# Altium schematic sheet MPU-6050_SCHEMATIC.SchDoc
size A4; SheetNumber: 1; SheetTotal: 1
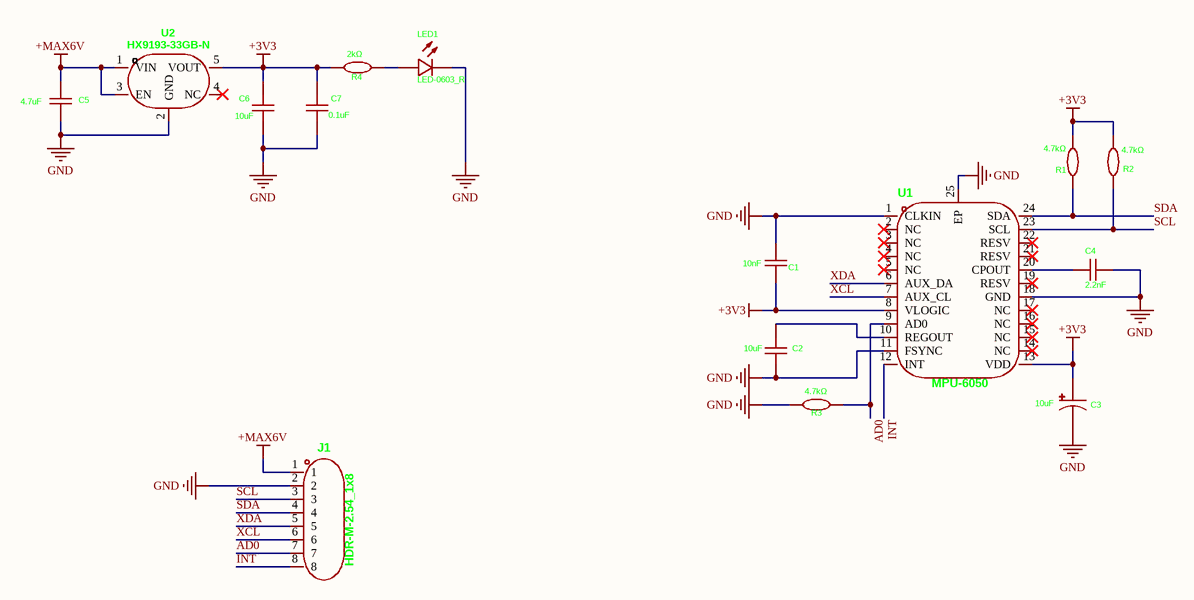
[diagram p0: MPU-6050_SCHEMATIC.SchDoc]

## Parts
C1  10nF  [C0402-10N F]
C2  10uF  [C0402-10u F]
C3  10uF  [CAP-SMD_L3.2-W1.6-10u F]
C4  2.2nF  [C0402-2.2n F]
C5  4.7uF  [C0402-4.7U F]
C6  10uF  [C0402-10u F]
C7  0.1uF  [C0402-0.1u f]
J1  HDR-M-2.54_1x8  [HDR-TH_8P-P2.54-V-M]
LED1  LED-0603_R  [LED0603-RD]
R1  4.7kΩ  [R0402-4.7K ohm]
R2  4.7kΩ  [R0402-4.7K ohm]
R3  4.7kΩ  [R0402-4.7K ohm]
R4  2kΩ  [R0402-2.2K OHM]
U1  MPU-6050  [QFN-24_L4.0-W4.0-P0.50-BL-EP2.7]
U2  HX9193-33GB-N  [SOT-23-5_L2.9-W1.6-P0.95-LS2.8-BL]

## Nets
+3V3: C1.1 C3.1 C6.2 C7.2 R1.2 R2.2 R4.1 U1.8(VLOGIC) U1.13(VDD) U2.5(VOUT)
+MAX6V: C5.2 J1.1 U2.1(VIN) U2.3(EN)
GND: C1.2 C2.1 C3.2 C4.1 C5.1 C6.1 C7.1 J1.2 LED1.1(C) R3.1 U1.1(CLKIN) U1.11(FSYNC) U1.18(GND) U1.25(EP) U2.2(GND)
AD0: J1.7 R3.2 U1.9(AD0)
INT: J1.8 U1.12(INT)
SCL: J1.3 R2.1 U1.23(SCL)
SDA: J1.4 R1.1 U1.24(SDA)
XCL: J1.6 U1.7(AUX_CL)
XDA: J1.5 U1.6(AUX_DA)
NetC2_2: C2.2 U1.10(REGOUT)
NetC4_2: C4.2 U1.20(CPOUT)
NetLED1_2: LED1.2(A) R4.2

Not connected (* = marked no-connect by the designer): U1 2(NC)* 3(NC)* 4(NC)* 5(NC)* 14(NC)* 15(NC)* 16(NC)* 17(NC)* 19(RESV)* 21(RESV)* 22(RESV)*; U2 4(NC)*

## Library data of the parts
C1 = CL05B103KB5NNNC: 50V 10nF X7R ±10% 0402 Multilayer Ceramic Capacitors MLCC - SMD/SMT ROHS; Manufacturer: SAMSUNG(三星); Add into BOM: yes; Symbol: CL05B103KB5NNNC; Device: CL05B103KB5NNNC; LCSC Part Name: 10nF ±10% 50V; Supplier Part: C15195; Manufacturer Part: CL05B103KB5NNNC; Supplier Footprint: 0402; JLCPCB Part Class: Basic Part; Datasheet: https://atta.szlcsc.com/upload/public/pdf/source/20160218/1457707763339.pdf; Supplier: LCSC; Convert to PCB: yes; Value: 10nF; Tolerance: ±10%
C2 C6 = CL05A106MP5NUNC_C315248: 10V 10uF X5R ±20% 0402 Multilayer Ceramic Capacitors MLCC - SMD/SMT ROHS; Manufacturer: SAMSUNG(三星); Add into BOM: yes; Symbol: CL05A106MP5NUNC_C315248; Device: CL05A106MP5NUNC_C315248; LCSC Part Name: 10uF ±20% 10V; Supplier Part: C315248; Manufacturer Part: CL05A106MP5NUNC; Supplier Footprint: 0402; JLCPCB Part Class: Extended Part; Datasheet: https://atta.szlcsc.com/upload/public/pdf/source/20231220/1EF805BAE1520675928CC4638D279E74.pdf; Supplier: LCSC; Convert to PCB: yes; Value: 10uF; Tolerance: ±20%
C3 = TPSA106K016R1000_C282116: 10uF 16V 1Ω@100kHz ±10% CASE-A-3216-18(mm) Tantalum Capacitors ROHS; Manufacturer: Kyocera AVX; Add into BOM: yes; Symbol: TPSA106K016R1000_C282116; Device: TPSA106K016R1000_C282116; LCSC Part Name: 10uF ±10% 16V; Supplier Part: C282116; Manufacturer Part: TPSA106K016R1000; Supplier Footprint: CASE-A-3216-18(mm); JLCPCB Part Class: Extended Part; Datasheet: https://atta.szlcsc.com/upload/public/pdf/source/20181129/C308928_3E6DA6FC57C95F0966ACBCD944046350.pdf; Supplier: LCSC; Convert to PCB: yes; Value: 10uF; Tolerance: ±10%; Equivalent Series Resistance(ESR): 1Ω@100kHz; Operating Temperature: -55℃~+125℃
C4 = GCM155R71H222KA37D: 50V 2.2nF X7R ±10% 0402 Multilayer Ceramic Capacitors MLCC - SMD/SMT ROHS; Manufacturer: muRata(村田); Add into BOM: yes; Symbol: GCM155R71H222KA37D; Device: GCM155R71H222KA37D; LCSC Part Name: 2.2nF ±10% 50V; Supplier Part: C126534; Manufacturer Part: GCM155R71H222KA37D; Supplier Footprint: 0402; JLCPCB Part Class: Extended Part; Datasheet: https://atta.szlcsc.com/upload/public/pdf/source/20170912/C126534_1505207904789963631.pdf; Supplier: LCSC; Convert to PCB: yes; Value: 2.2nF; Tolerance: ±10%; Voltage Rating: 50V; Temperature Coefficient: X7R
C5 = CL05A475MP5NRNC: 10V 4.7uF X5R ±20% 0402 Multilayer Ceramic Capacitors MLCC - SMD/SMT ROHS; Manufacturer: SAMSUNG(三星); Add into BOM: yes; Symbol: CL05A475MP5NRNC; Device: CL05A475MP5NRNC; LCSC Part Name: 4.7uF ±20% 10V; Supplier Part: C23733; Manufacturer Part: CL05A475MP5NRNC; Supplier Footprint: 0402; JLCPCB Part Class: Basic Part; Datasheet: https://atta.szlcsc.com/upload/public/pdf/source/20160218/1457707763339.pdf; Supplier: LCSC; Convert to PCB: yes; Value: 4.7uF; Tolerance: ±20%
C7 = GRM155R71H104KE14D: 50V 100nF X7R ±10% 0402 Multilayer Ceramic Capacitors MLCC - SMD/SMT ROHS; Manufacturer: muRata(村田); Add into BOM: yes; Symbol: GRM155R71H104KE14D; Device: GRM155R71H104KE14D; LCSC Part Name: 100nF ±10% 50V; Supplier Part: C77020; Manufacturer Part: GRM155R71H104KE14D; Supplier Footprint: 0402; JLCPCB Part Class: Extended Part; Datasheet: https://atta.szlcsc.com/upload/public/pdf/source/20180326/C77020_39BD49C951FF1AF0DB1F1FAC5AC1E401.pdf; Supplier: LCSC; Convert to PCB: yes; Value: 100nF; Tolerance: ±10%
J1 = Z-211-0811-0021-001: Straight Policy 2.5mm 8P 6mm -25℃~+105℃ 3mm 2.54mm Single Row Black Brass 1x8P Plugin,P=2.54mm Pin Headers ROHS; Manufacturer: Nextron(正凌); Add into BOM: yes; Circluar Pins/Square Pins: Square Pins; Symbol: Z-211-0811-0021-001; Device: Z-211-0811-0021-001; LCSC Part Name: 间距:2.54mm 1x8P 直插 方针; Supplier Part: C190820; Manufacturer Part: Z-211-0811-0021-001; Supplier Footprint: 插件,P=2.54mm; JLCPCB Part Class: Extended Part; Datasheet: https://atta.szlcsc.com/upload/public/pdf/source/20180525/C190820_686788E98164DB7F14582F9FE3B4A39E.pdf; Supplier: LCSC; Convert to PCB: yes; Pin Structure: 1x8P; Pitch: 2.54mm; Row Spacing: -; Mounting Type: Straight; Number of Rows: Plugin; Number of Pins: 8P; Current Rating (Max): -; Voltage Rating (Max): -; Length of Mating Pin: 6mm; Insulation Height: 2.5mm; Length of End Connection Pin: 3mm; Contact Plating: -; Operating Temperature Range: -25℃~+105℃; Color: Black
LED1 = 19-217/R6C-AL1M2VY/3T: 5mA Colorless Transparent Lens -40℃~+85℃ 617.5nm Red 120° 60mW 1.95V 0603 LED Indication - Discrete ROHS; Manufacturer: EVERLIGHT(亿光); Add into BOM: yes; Peak Wavelength: 632nm; Symbol: 19-217/R6C-AL1M2VY/3T; Device: 19-217/R6C-AL1M2VY/3T; LCSC Part Name: 红灯 停产 停产; Supplier Part: C72044; Manufacturer Part: 19-217/R6C-AL1M2VY/3T; Supplier Footprint: 0603; JLCPCB Part Class: Extended Part; Datasheet: https://atta.szlcsc.com/upload/public/pdf/source/20160507/1462613613821.pdf; Supplier: LCSC; Convert to PCB: yes; Emitted Color: Red; Forward Voltage (VF): 1.95V; Power Dissipation: 60mW; Forward Current: 5mA; Dominant Wavelength: 617.5nm; Diode Configuration: -; Lens Color: Colorless Transparent Lens; Color Temperature: -; Viewing Angle: 120°; Mounting Sytle: -; Operating Temperature: -40℃~+85℃
R1-R3 = RC0402FR-074K7L: 62.5mW Thick Film Resistors 50V ±100ppm/℃ ±1% 4.7kΩ 0402 Chip Resistor - Surface Mount ROHS; Manufacturer: YAGEO(国巨); Add into BOM: yes; Symbol: RC0402FR-074K7L; Device: RC0402FR-074K7L; LCSC Part Name: 厚膜电阻 4.7kΩ ±1% 62.5mW; Supplier Part: C105871; Manufacturer Part: RC0402FR-074K7L; Supplier Footprint: 0402; JLCPCB Part Class: Extended Part; Datasheet: https://atta.szlcsc.com/upload/public/pdf/source/20180821/C275644_0D56F95EFF785E7D9A1FEF436B37DA78.pdf; Supplier: LCSC; Convert to PCB: yes; Type: Thick Film Resistors; Value: 4.7kΩ; Tolerance: ±1%; Temperature Coefficient: ±100ppm/℃; Operating Temperature Range: -55℃~+155℃
R4 = RC0402FR-072KL: 62.5mW Thick Film Resistors 50V ±100ppm/℃ ±1% 2kΩ 0402 Chip Resistor - Surface Mount ROHS; Manufacturer: YAGEO(国巨); Add into BOM: yes; Symbol: RC0402FR-072KL; Device: RC0402FR-072KL; LCSC Part Name: 厚膜电阻 2kΩ ±1% 62.5mW; Supplier Part: C60488; Manufacturer Part: RC0402FR-072KL; Supplier Footprint: 0402; JLCPCB Part Class: Extended Part; Datasheet: https://atta.szlcsc.com/upload/public/pdf/source/20180821/C275644_0D56F95EFF785E7D9A1FEF436B37DA78.pdf; Supplier: LCSC; Convert to PCB: yes; Type: Thick Film Resistors; Value: 2kΩ; Tolerance: ±1%; Temperature Coefficient: ±100ppm/℃; Operating Temperature Range: -55℃~+155℃
U1 = MPU-6050: Accelerometer gyroscope QFN-24-EP(4x4) Accelerometers ROHS; Manufacturer: TDK InvenSense(应美盛); Symbol: MPU-6050_C24112; Add into BOM: yes; Sensor Type: 加速度计陀螺仪; Device: MPU-6050; LCSC Part Name: MPU-6050; Supplier Part: C24112; Manufacturer Part: MPU-6050; Supplier Footprint: QFN-24-EP(4x4); JLCPCB Part Class: Extended Part; Datasheet: https://atta.szlcsc.com/upload/public/pdf/source/20140425/1457707046159.pdf; Supplier: LCSC; Convert to PCB: yes; Operating Temperature: -40℃~+85℃
U2 = HX9193-33GB-N: 300mA Fixed 3.3V 7V SOT-23-5 Voltage Regulators - Linear, Low Drop Out (LDO) Regulators ROHS; Manufacturer: HX(恒佳兴); Add into BOM: yes; Symbol: HX9193-33GB-N; Device: HX9193-33GB-N; LCSC Part Name: HX9193-33GB-N; Supplier Part: C2995655; Manufacturer Part: HX9193-33GB-N; Supplier Footprint: SOT-23-5; JLCPCB Part Class: Extended Part; Datasheet: https://atta.szlcsc.com/upload/public/pdf/source/20220412/18D9B33FD58646224E88440BBF52FED7.pdf; Supplier: LCSC; Convert to PCB: yes; Output Type: -; Voltage - Supply: -; Output Voltage: 3.3V; Output Current: 300mA; Power Supply Rejection Ratio (PSRR): -; Voltage Dropout: -; standby current: -; Noise: -; Features: Low ESR；Overcurrent Protection(OCP)；With ability; Operating Temperature: -; Output Configuration: -; Number of Outputs: -